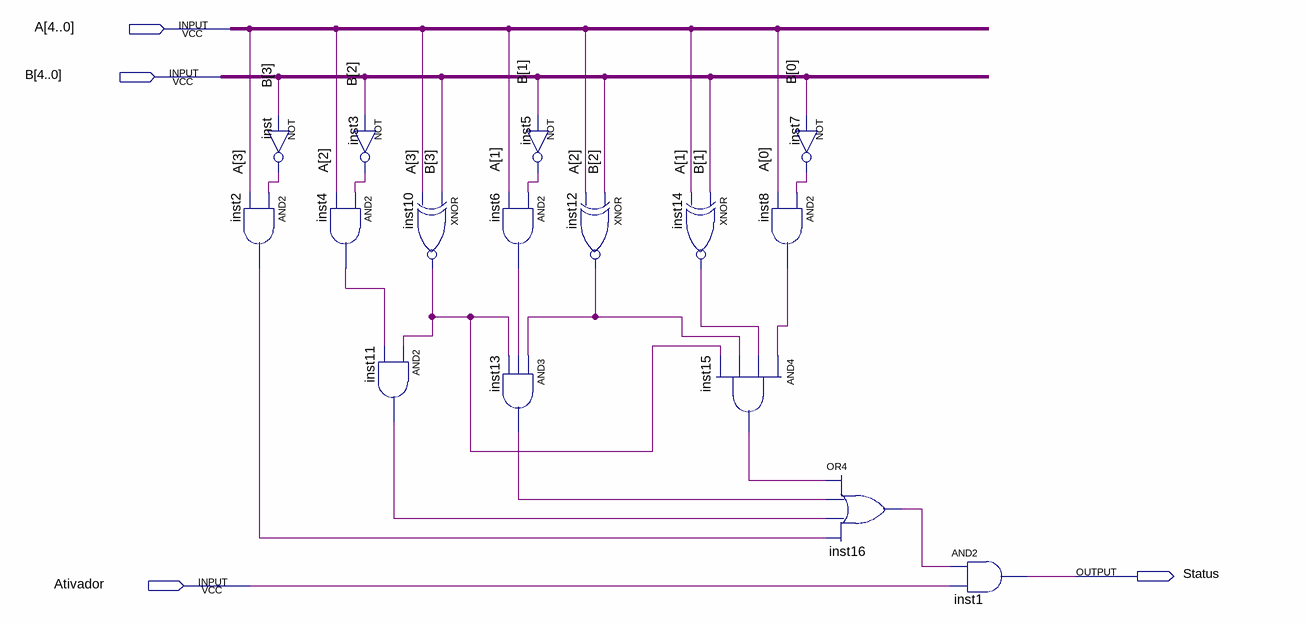
[diagram p0: schematic sheet]
// Quartus schematic AMaiorQueB.bdf as structural Verilog: 16 symbols, 4 pins
module AMaiorQueB (
  input  [4:0] A,
  input  [4:0] B,
  input  Ativador,
  output Status
);

  wire inst2_out, inst3_out, inst4_out, inst5_out, inst6_out, inst7_out, inst8_out, inst10_out, inst11_out,
       inst12_out, inst13_out, inst14_out, inst15_out, inst16_out, inst_out;

  and inst2 (inst2_out, inst_out, A[3]);
  not inst (inst_out, B[3]);
  and inst4 (inst4_out, inst3_out, A[2]);
  not inst3 (inst3_out, B[2]);
  xnor inst10 (inst10_out, B[3], A[3]);
  and inst11 (inst11_out, inst10_out, inst4_out);
  not inst5 (inst5_out, B[1]);
  and inst6 (inst6_out, inst5_out, A[1]);
  and inst13 (inst13_out, inst12_out, inst6_out, inst10_out);
  xnor inst12 (inst12_out, B[2], A[2]);
  xnor inst14 (inst14_out, B[1], A[1]);
  and inst15 (inst15_out, inst8_out, inst14_out, inst12_out, inst10_out);
  not inst7 (inst7_out, B[0]);
  and inst8 (inst8_out, inst7_out, A[0]);
  or inst16 (inst16_out, inst15_out, inst13_out, inst11_out, inst2_out);
  and inst1 (Status, inst16_out, Ativador);
endmodule
